# EAGLE design BitBeacon (EAGLE 7.4.0)
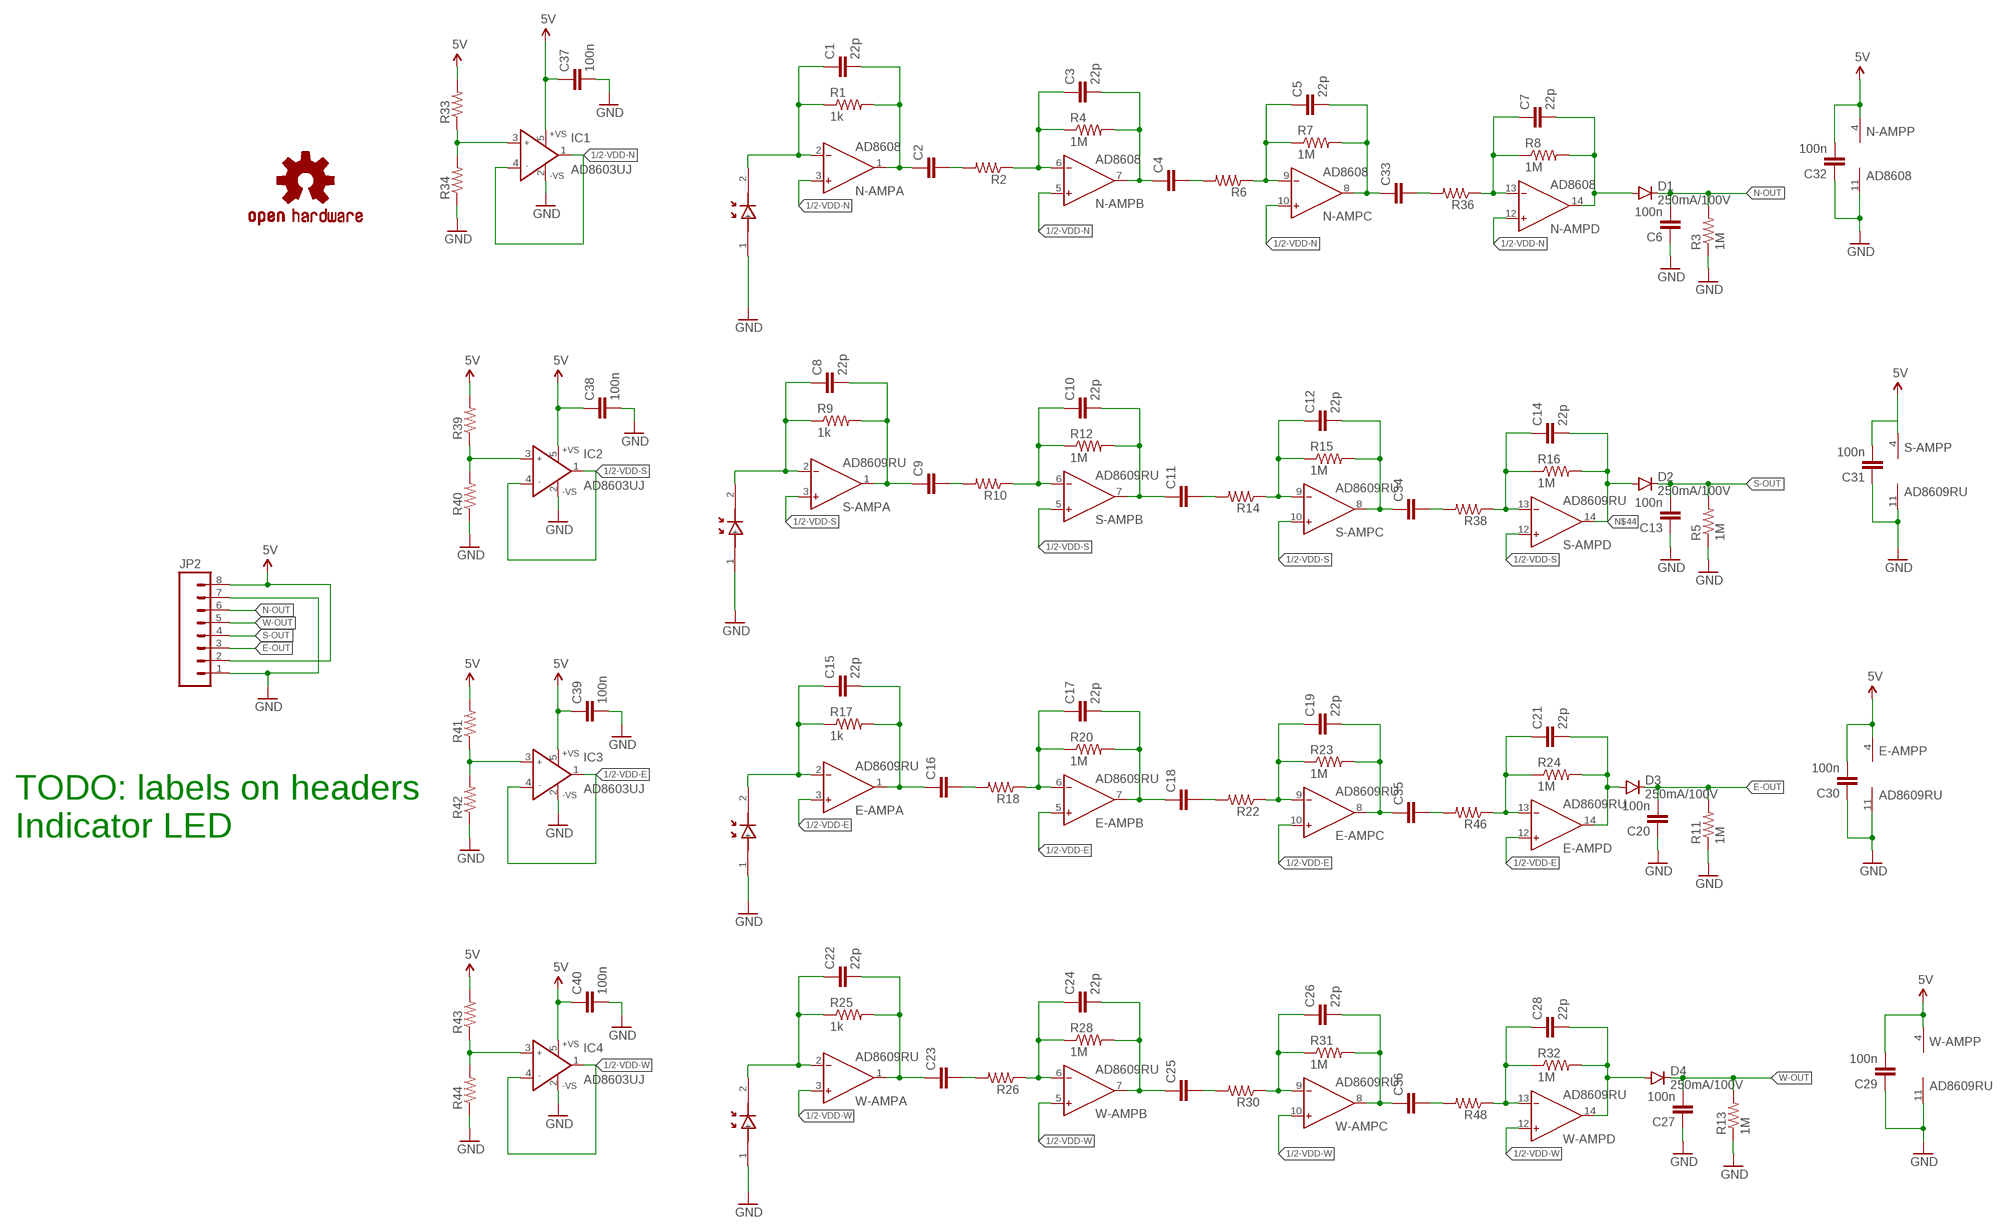
[diagram p0: schematic, sheet 1]

## Parts
C1  22p  C-EUC0402  [C0402]
C2  C-EUC0402  [C0402]
C3  22p  C-EUC0402  [C0402]
C4  C-EUC0402  [C0402]
C5  22p  C-EUC0402  [C0402]
C6  100n  C-EUC0402  [C0402]
C7  22p  C-EUC0402  [C0402]
C8  22p  C-EUC0402  [C0402]
C9  C-EUC0402  [C0402]
C10  22p  C-EUC0402  [C0402]
C11  C-EUC0402  [C0402]
C12  22p  C-EUC0402  [C0402]
C13  100n  C-EUC0402  [C0402]
C14  22p  C-EUC0402  [C0402]
C15  22p  C-EUC0402  [C0402]
C16  C-EUC0402  [C0402]
C17  22p  C-EUC0402  [C0402]
C18  C-EUC0402  [C0402]
C19  22p  C-EUC0402  [C0402]
C20  100n  C-EUC0402  [C0402]
C21  22p  C-EUC0402  [C0402]
C22  22p  C-EUC0402  [C0402]
C23  C-EUC0402  [C0402]
C24  22p  C-EUC0402  [C0402]
C25  C-EUC0402  [C0402]
C26  22p  C-EUC0402  [C0402]
C27  100n  C-EUC0402  [C0402]
C28  22p  C-EUC0402  [C0402]
C29  100n  C-EUC0402  [C0402]
C30  100n  C-EUC0402  [C0402]
C31  100n  C-EUC0402  [C0402]
C32  100n  C-EUC0402  [C0402]
C33  C-EUC0402  [C0402]
C34  C-EUC0402  [C0402]
C35  C-EUC0402  [C0402]
C36  C-EUC0402  [C0402]
C37  100n  C-EUC0402  [C0402]
C38  100n  C-EUC0402  [C0402]
C39  100n  C-EUC0402  [C0402]
C40  100n  C-EUC0402  [C0402]
D1  250mA/100V  DIODEBAS16  [SOD-323]
D2  250mA/100V  DIODEBAS16  [SOD-323]
D3  250mA/100V  DIODEBAS16  [SOD-323]
D4  250mA/100V  DIODEBAS16  [SOD-323]
E-AMP  AD8609RU  [TSSOP14]
E-PD1  BPW46  [PIN-PHOTODIODE]
IC1  AD8603UJ  [SOT23-5]
IC2  AD8603UJ  [SOT23-5]
IC3  AD8603UJ  [SOT23-5]
IC4  AD8603UJ  [SOT23-5]
JP2  M08NO_SILK  [1X08_PIN1_NO_SILK]
LOGO1  OSHW-LOGOS  [OSHW-LOGO-S]
N-AMP  AD8608  AD8609RU  [TSSOP14]
N-PD1  BPW46  [PIN-PHOTODIODE]
R1  1k  R-US_R0402  [R0402]
R2  R-US_R0402  [R0402]
R3  1M  R-US_R0402  [R0402]
R4  1M  R-US_R0402  [R0402]
R5  1M  R-US_R0402  [R0402]
R6  R-US_R0402  [R0402]
R7  1M  R-US_R0402  [R0402]
R8  1M  R-US_R0402  [R0402]
R9  1k  R-US_R0402  [R0402]
R10  R-US_R0402  [R0402]
R11  1M  R-US_R0402  [R0402]
R12  1M  R-US_R0402  [R0402]
R13  1M  R-US_R0402  [R0402]
R14  R-US_R0402  [R0402]
R15  1M  R-US_R0402  [R0402]
R16  1M  R-US_R0402  [R0402]
R17  1k  R-US_R0402  [R0402]
R18  R-US_R0402  [R0402]
R20  1M  R-US_R0402  [R0402]
R22  R-US_R0402  [R0402]
R23  1M  R-US_R0402  [R0402]
R24  1M  R-US_R0402  [R0402]
R25  1k  R-US_R0402  [R0402]
R26  R-US_R0402  [R0402]
R28  1M  R-US_R0402  [R0402]
R30  R-US_R0402  [R0402]
R31  1M  R-US_R0402  [R0402]
R32  1M  R-US_R0402  [R0402]
R33  R-US_R0402  [R0402]
R34  R-US_R0402  [R0402]
R36  R-US_R0402  [R0402]
R38  R-US_R0402  [R0402]
R39  R-US_R0402  [R0402]
R40  R-US_R0402  [R0402]
R41  R-US_R0402  [R0402]
R42  R-US_R0402  [R0402]
R43  R-US_R0402  [R0402]
R44  R-US_R0402  [R0402]
R46  R-US_R0402  [R0402]
R48  R-US_R0402  [R0402]
S-AMP  AD8609RU  [TSSOP14]
S-PD1  BPW46  [PIN-PHOTODIODE]
W-AMP  AD8609RU  [TSSOP14]
W-PD1  BPW46  [PIN-PHOTODIODE]

## Nets
1/2-VDD-E: E-AMP.3(A:IN+) E-AMP.5(B:IN+) E-AMP.10(C:IN+) E-AMP.12(D:IN+) IC3.1(OUT) IC3.4(IN-)
1/2-VDD-N: IC1.1(OUT) IC1.4(IN-) N-AMP.3(A:IN+) N-AMP.5(B:IN+) N-AMP.10(C:IN+) N-AMP.12(D:IN+)
1/2-VDD-S: IC2.1(OUT) IC2.4(IN-) S-AMP.3(A:IN+) S-AMP.5(B:IN+) S-AMP.10(C:IN+) S-AMP.12(D:IN+)
1/2-VDD-W: IC4.1(OUT) IC4.4(IN-) W-AMP.3(A:IN+) W-AMP.5(B:IN+) W-AMP.10(C:IN+) W-AMP.12(D:IN+)
5V: C29.2 C30.2 C31.2 C32.2 C37.1 C38.1 C39.1 C40.1 E-AMP.4(P:V+) IC1.5(+VS) IC2.5(+VS) IC3.5(+VS) IC4.5(+VS) JP2.2 JP2.8 N-AMP.4(P:V+) R33.2 R39.2 R41.2 R43.2 S-AMP.4(P:V+) W-AMP.4(P:V+)
E-OUT: C20.2 D3.C JP2.3 R11.2
GND: C6.1 C13.1 C20.1 C27.1 C29.1 C30.1 C31.1 C32.1 C37.2 C38.2 C39.2 C40.2 E-AMP.11(P:V-) E-PD1.1(+) IC1.2(-VS) IC2.2(-VS) IC3.2(-VS) IC4.2(-VS) JP2.1 JP2.7 N-AMP.11(P:V-) N-PD1.1(+) R3.1 R5.1 R11.1 R13.1 R34.1 R40.1 R42.1 R44.1 S-AMP.11(P:V-) S-PD1.1(+) W-AMP.11(P:V-) W-PD1.1(+)
N$1: C1.1 N-AMP.2(A:IN-) N-PD1.2(-) R1.1
N$2: C14.1 R16.1 R38.1 S-AMP.13(D:IN-)
N$3: C1.2 C2.1 N-AMP.1(A:OUT) R1.2
N$4: C8.1 R9.1 S-AMP.2(A:IN-) S-PD1.2(-)
N$5: C3.1 N-AMP.6(B:IN-) R2.1 R4.1
N$6: C3.2 C4.1 N-AMP.7(B:OUT) R4.2
N$7: C5.1 N-AMP.9(C:IN-) R6.1 R7.1
N$8: C5.2 C33.1 N-AMP.8(C:OUT) R7.2
N$9: IC1.3(IN+) R33.1 R34.2
N$10: C7.1 N-AMP.13(D:IN-) R8.1 R36.1
N$11: C7.2 D1.A N-AMP.14(D:OUT) R8.2
N$12: C10.1 R10.1 R12.1 S-AMP.6(B:IN-)
N$13: C10.2 C11.1 R12.2 S-AMP.7(B:OUT)
N$14: C12.1 R14.1 R15.1 S-AMP.9(C:IN-)
N$15: C12.2 C34.1 R15.2 S-AMP.8(C:OUT)
N$16: IC2.3(IN+) R39.1 R40.2
N$17: IC3.3(IN+) R41.1 R42.2
N$18: IC4.3(IN+) R43.1 R44.2
N$19: C15.1 E-AMP.2(A:IN-) E-PD1.2(-) R17.1
N$20: C15.2 C16.1 E-AMP.1(A:OUT) R17.2
N$21: C17.1 E-AMP.6(B:IN-) R18.1 R20.1
N$22: C17.2 C18.1 E-AMP.7(B:OUT) R20.2
N$23: C19.1 E-AMP.9(C:IN-) R22.1 R23.1
N$24: C19.2 C35.1 E-AMP.8(C:OUT) R23.2
N$25: C28.1 R32.1 R48.1 W-AMP.13(D:IN-)
N$26: C21.1 E-AMP.13(D:IN-) R24.1 R46.1
N$27: C2.2 R2.2
N$28: C22.1 R25.1 W-AMP.2(A:IN-) W-PD1.2(-)
N$29: C22.2 C23.1 R25.2 W-AMP.1(A:OUT)
N$30: C24.1 R26.1 R28.1 W-AMP.6(B:IN-)
N$31: C24.2 C25.1 R28.2 W-AMP.7(B:OUT)
N$32: C26.1 R30.1 R31.1 W-AMP.9(C:IN-)
N$33: C26.2 C36.1 R31.2 W-AMP.8(C:OUT)
N$34: C4.2 R6.2
N$35: C33.2 R36.2
N$36: C34.2 R38.2
N$37: C11.2 R14.2
N$38: C9.2 R10.2
N$39: C35.2 R46.2
N$40: C18.2 R22.2
N$41: C16.2 R18.2
N$42: C36.2 R48.2
N$43: C25.2 R30.2
N$44: C14.2 D2.A R16.2 S-AMP.14(D:OUT)
N$45: C23.2 R26.2
N$46: C21.2 D3.A E-AMP.14(D:OUT) R24.2
N$47: C28.2 D4.A R32.2 W-AMP.14(D:OUT)
N-OUT: C6.2 D1.C JP2.6 R3.2
S-AMP: C8.2 C9.1 R9.2 S-AMP.1(A:OUT)
S-OUT: C13.2 D2.C JP2.4 R5.2
W-OUT: C27.2 D4.C JP2.5 R13.2

## Notes on the sheet
- TODO: labels on headers
  Indicator LED

## Library data of the parts
C1-C40 = resistor:C-EU: CAPACITOR, European symbol
D1-D4 = SparkFun-DiscreteSemi:DIODE: Diode These are standard reverse protection diodes and small signal diodes. SMA package can handle up to about 1A. SOD-323 can handle about 200mA. What the SOD-323 package when ordering, there are some mfgs out there that are 5-pin packages.; PROD_ID: DIO-09646
E-AMP N-AMP S-AMP W-AMP = analog-devices:AD8609: Precision Micropower, Low Noise CMOS, Rail-to-Rail Input/Output Operational Amplifiers Source: http://www.analog.com/static/imported-files/data_sheets/AD8603_8607_8609.pdf; MF: ALTERA CORPORATION; MPN: AD8609ARUZ; OC_FARNELL: 1464994; OC_NEWARK: 59K6934
E-PD1 N-PD1 S-PD1 W-PD1 = Orlando:BPW46
IC1-IC4 = analog-devices:AD8603: Precision Micropower, Low Noise CMOS, Rail-to-Rail Input/Output Operational Amplifiers Source: http://www.analog.com/static/imported-files/data_sheets/AD8603_8607_8609.pdf; MF: ALTERA CORPORATION; MPN: AD8603AUJZ-REEL7; OC_FARNELL: 1651290; OC_NEWARK: 59K6904
JP2 = SparkFun-Connectors:M08: Header 8 Standard 8-pin 0.1" header. Use with straight break away headers (SKU : PRT-00116), right angle break away headers (PRT-00553), swiss pins (PRT-00743), machine pins (PRT-00117), and female headers (PRT-00115).
LOGO1 = SparkFun-Aesthetics:OSHW-LOGO: Open Source Hardware Logo This logo indicates the piece of hardware it is found on incorporates a OSHW license and/or adheres to the definition of open source hardware found here: http://freedomdefined.org/OSHW
R1-R18 R20 R22-R26 R28 R30-R34 R36 R38-R44 R46 R48 = resistor:R-US_: RESISTOR, American symbol

## Board
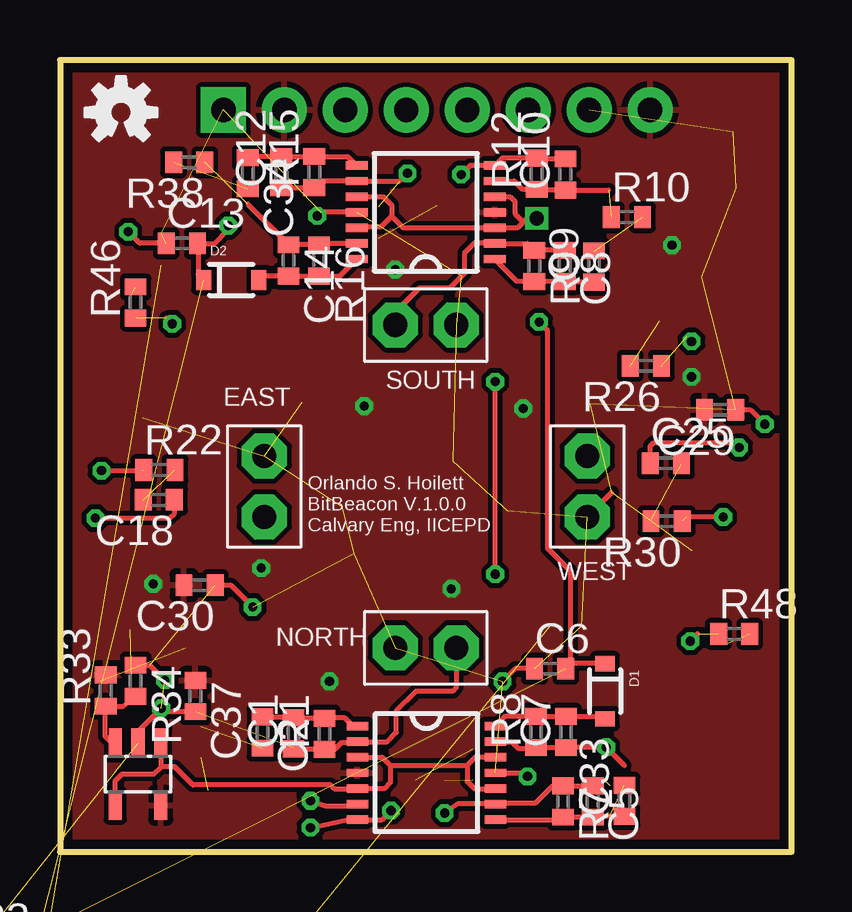
[diagram p1: board, top side]
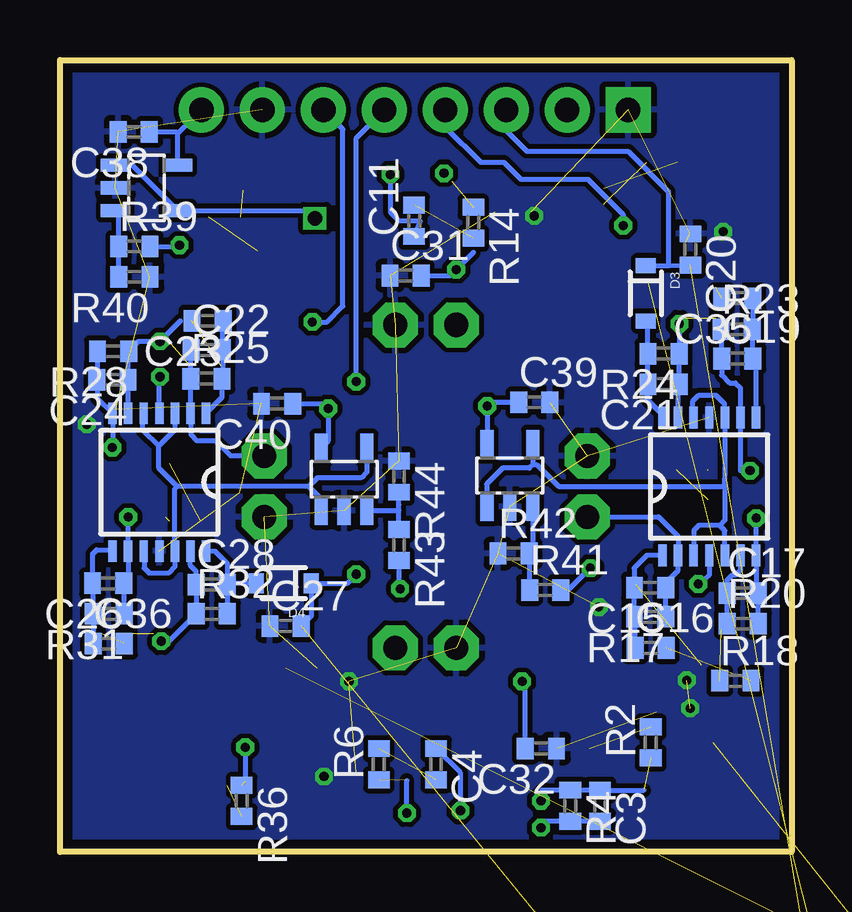
[diagram p2: board, bottom side, seen from below]

Size 30.48 x 33.02 mm. Coordinates in mm from the lower left corner, seen from the top.
Outline: 0,0 30.48,0 30.48,33.02 0,33.02 0,0
Copper layers (1*16): Top 0.0356mm / dielectric 1.5011mm / Bottom 0.0356mm
Design rules "LaenPCBOrder": minimum track width 6mil, minimum drill 13mil, track to track 6mil, track to pad 6mil, pad to pad 6mil, via to via 6mil, smd to smd 6mil, copper to edge 15mil, drill to drill 6mil, minimum pad ring 7mil, minimum via ring 7mil, stop-mask expansion 3mil, vias tented up to drill 0mil, thermal gap 10mil

### Footprints (pad centres in the part's own frame; a part is rotated, then mirrored left to right if it is on the bottom)
C0402 = smd 0.7 x 0.9: 1 -0.65,0; 2 0.65,0
SOD-323 = smd 0.63 x 0.83: A 1.15,0; C -1.15,0
TSSOP14 = smd 0.9 x 0.35: 1 -2.875,1.95; 2 -2.875,1.3; 3 -2.875,0.65; 4 -2.875,0; 5 -2.875,-0.65; 6 -2.875,-1.3; 7 -2.875,-1.95; 8 2.875,-1.95; 9 2.875,-1.3; 10 2.875,-0.65; 11 2.875,0; 12 2.875,0.65; 13 2.875,1.3; 14 2.875,1.95
PIN-PHOTODIODE = drill 1.016 pad 1.88 octagon: 1 -1.27,0; 2 1.27,0
SOT23-5 = smd 0.55 x 1.2: 1 -0.95,-1.3; 2 0,-1.3; 3 0.95,-1.3; 4 0.95,1.3; 5 -0.95,1.3
1X08_PIN1_NO_SILK = drill 1.016 pad 1.88 square: 1 0,0 | drill 1.016 pad 1.88: 2 2.54,0; 3 5.08,0; 4 7.62,0; 5 10.16,0; 6 12.7,0; 7 15.24,0; 8 17.78,0
R0402 = smd 0.7 x 0.9: 1 -0.65,0; 2 0.65,0

### Placement (x,y rotation side)
C1  9.73,4.95 90 top
C2  8.43,4.98 270 top
C3  7.98,1.93 270 bottom
C4  14.81,3.66 270 bottom
C5  22.2,2.11 270 top
C6  20.42,7.65 0 top
C7  21.08,5 90 top
C8  21.03,24.43 270 top
C9  22.25,24.41 90 top
C10  21.06,28.24 90 top
C11  15.72,26.31 90 bottom
C12  9.22,28.35 90 top
C13  5.08,25.37 0 top
C14  9.53,24.66 270 top
C15  5.89,11.02 180 bottom
C16  5.87,8.51 0 bottom
C17  2.03,10.79 0 bottom
C18  4.11,14.68 180 top
C19  2.26,20.57 0 bottom
C20  4.22,25.12 270 bottom
C21  5.33,19.51 180 bottom
C22  24.36,20.93 0 bottom
C23  24.33,22.15 180 bottom
C24  28.3,19.68 180 bottom
C25  25.25,16.21 0 top
C26  28.47,11.2 180 bottom
C27  21.08,9.42 0 bottom
C28  24.16,11.15 0 bottom
C29  27.51,18.44 180 top
C30  5.82,11.13 180 top
C31  16.08,24.03 0 bottom
C32  10.44,4.32 180 bottom
C33  23.52,2.13 90 top
C34  7.82,28.3 270 top
C35  2.26,23.09 180 bottom
C36  28.45,8.69 0 bottom
C37  5.64,6.5 270 top
C38  27.41,30.02 180 bottom
C39  10.72,18.75 0 bottom
C40  21.44,18.69 180 bottom
D1  22.71,6.71 270 top
D2  7.14,23.85 0 top
D3  6.07,23.29 270 bottom
D4  21.16,11.2 180 bottom
E-AMP  3.43,15.24 90 bottom
E-PD1  8.51,15.24 270 top
IC1  3.25,3.25 180 top
IC2  26.87,27.69 270 bottom
IC3  11.73,15.7 0 bottom
IC4  18.64,15.54 0 bottom
JP2  6.81,30.94 0 top
LOGO1  2.54,30.84 0 top
N-AMP  15.27,3.3 0 top
N-PD1  15.24,8.51 0 top
R1  11.02,4.93 90 top
R2  5.87,4.57 90 bottom
R3  -2.9,-4.01 0 top  (outside the outline)
R4  9.22,1.93 270 bottom
R5  -2.9,-8.79 0 top  (outside the outline)
R6  17.2,3.66 90 bottom
R7  20.95,2.11 270 top
R8  19.84,5 90 top
R9  19.76,24.43 270 top
R10  23.62,26.47 0 top
R11  -2.9,-13.56 0 top  (outside the outline)
R12  19.86,28.27 90 top
R13  -2.9,-18.34 0 top  (outside the outline)
R14  13.26,26.24 270 bottom
R15  10.59,28.35 90 top
R16  10.79,24.66 270 top
R17  5.89,9.8 180 bottom
R18  2.34,7.14 0 bottom
R20  2.03,9.53 0 bottom
R22  4.14,15.93 0 top
R23  2.29,21.79 0 bottom
R24  5.33,20.78 180 bottom
R25  24.38,19.74 0 bottom
R26  24.41,20.27 180 top
R28  28.27,20.88 180 bottom
R30  25.27,13.79 180 top
R31  28.45,9.93 180 bottom
R32  24.16,9.93 0 bottom
R33  1.91,6.73 90 top
R34  3.15,7.14 270 top
R36  22.91,2.13 270 bottom
R38  5.38,28.75 180 top
R39  27.38,25.25 0 bottom
R40  27.38,23.98 180 bottom
R41  10.26,10.92 0 bottom
R42  11.58,12.45 0 bottom
R43  16.36,12.8 270 bottom
R44  16.36,15.65 270 bottom
R46  3.15,22.91 90 top
R48  28.09,9.09 0 top
S-AMP  15.24,26.67 180 top
S-PD1  15.24,21.97 180 top
W-AMP  26.34,15.42 270 bottom
W-PD1  21.97,15.24 90 top

### Tracks (layer width: path | path; a pad name or v marks a point on that pad's centre or on a via)
1/2-VDD-E
  Bottom 0.203: E-AMP.5 2.78,13.4 3,13.61 | 3,13.61 3.86,13.61 4.06,13.41 4.06,12.38 E-AMP.3 | E-AMP.12 4.12,18.08 4.12,18.8 3.86,19.05 3.15,19.05 2.79,18.69 2.79,18.13 E-AMP.10 2.78,15.6 2.78,15.24 | 2.78,15.24 9.7,15.24 10.62,16.15 10.77,16.15 10.79,16.14 | IC3.4 10.79,16.14 | 10.79,16.14 10.92,16 12.04,16 12.7,15.34 12.7,14.41 IC3.1 | 2.78,15.24 2.78,13.83 3,13.61
1/2-VDD-N
  Top 0.203: N-AMP.3 13.42,3.95 13.77,3.61 | 13.77,3.61 13.77,2.9 13.51,2.64 N-AMP.5 11.43,2.64 11.28,2.79 5.54,2.79 4.78,3.56 4.22,3.56 | N-AMP.12 17.31,3.95 16.97,3.61 | 16.97,3.61 16.97,2.95 17.27,2.64 N-AMP.10 | 4.22,4.28 IC1.1 4.22,4.54 4.22,3.56 | 13.77,3.61 16.97,3.61 | IC1.4 2.3,2.96 2.59,3.25 3.91,3.25 4.22,3.56
1/2-VDD-S  (via drill 0.6)
  Top 0.203: v19.86,26.42 19.46,26.42 19.3,26.26 | 19.3,26.26 19.05,26.01 S-AMP.3 14.31,26.02 13.82,26.52 | S-AMP.10 13.47,27.32 13.82,26.98 13.82,26.52 | 13.82,26.52 13.36,26.06 12.4,26.06 S-AMP.12 | S-AMP.5 18.76,27.32 18.95,27.13 18.95,26.62 19.3,26.26
  Bottom 0.203: IC2.1 27.47,28.64 IC2.4 20.18,26.74 v19.86,26.42
1/2-VDD-W
  Bottom 0.203: 26.36,16.92 27.03,17.58 27.03,18.26 W-AMP.5 | W-AMP.3 25.69,17.59 26.36,16.92 | 25.6,15.24 26.36,16 26.36,16.92 | 20.12,15.24 25.6,15.24 | W-AMP.10 26.98,12.53 26.98,11.84 26.77,11.63 25.96,11.63 25.69,11.9 W-AMP.12 25.69,15.15 25.6,15.24 | IC4.4 17.69,15.83 17.93,15.6 19.76,15.6 20.12,15.24 | IC4.1 19.59,14.72 20.12,15.24
5V  (via drill 0.38)
  Bottom 0.203: E-AMP.4 3.43,11.53 v3.89,11.18 | R39.2 25.55,25.25 v25.5,25.3 | IC2.5 25.57,29.95 | 25.57,29.95 JP2.8 | C32.2 11.09,6.97 v11.23,7.11 | W-AMP.4 26.34,19.79 v26.31,19.81 | R41.2 9.3,10.92 v8.38,11.84 | 13.26,24.99 v13.97,24.28 | 14.02,24.33 v13.97,24.28 | C31.2 14.22,24.03 v13.97,24.28 | C40.1 19.51,18.69 v19.3,18.49 19.3,17.13 IC4.5 | IC3.5 v12.68,18.59 12.52,18.75 C39.1 | C38.1 25.64,30.02 25.57,29.95 | R43.2 16.36,11.02 v16.31,10.97
  pour Top (isolate 0.203): 30.48,33.02 30.48,0 0,0 0,33.02
E-OUT  (1 unrouted)
  Bottom 0.203: D3.C 5.1,24.44 | 5.1,24.44 C20.2 | JP2.3 11.89,30.07 11.02,29.21 6.81,29.21 5.13,27.53 5.13,24.47 5.1,24.44
GND  (via drill 0.38)  (32 unrouted)
  Top 0.203: N-AMP.11 19.33,3.3 v19.48,3.15 | 22.99,14.99 W-PD1.1 | C6.1 18.97,7.64 v18.44,7.11 | C29.1 28.75,18.44 v29.36,17.83 | C30.1 7.11,11.12 v8.03,10.21 | S-AMP.11 10.87,26.67 v10.72,26.52 | C13.1 3.33,25.38 v2.85,25.86 | R34.1 3.74,7.79 v4.37,7.16 | C37.2 4.36,5.85 v4.22,5.99 3.25,5.03 IC1.2
  pour Bottom (isolate 0.203): 30.48,33.02 30.48,0 0,0 0,33.02
N$1
  Top 0.203: N-PD1.2 16.51,6.86 16.36,6.71 14.83,6.71 14.02,5.89 14.02,4.98 13.64,4.6 N-AMP.2 12.36,4.57 11.73,4.57 11.44,4.28 R1.1 11,4.3 C1.1
N$2  (1 unrouted)
  Top 0.203: S-AMP.13 10.85,25.37 R16.1 C14.1 7.82,27.02
N$3
  Top 0.203: N-AMP.1 12.2,5.25 11.86,5.59 11.03,5.59 R1.2 10.01,5.58 C1.2 9.7,5.63 C2.1
N$4
  Top 0.203: C8.1 R9.1 19.48,25.37 S-AMP.2 18.09,25.4 17.27,25.4 16.87,24.99 16.87,24.13 16.26,23.52 14.99,23.52 13.97,22.5 S-PD1.2
N$5  (via drill 0.38)  (1 unrouted)
  Top 0.203: v10.44,2.13 11.05,1.93 12.32,1.93 N-AMP.6
  Bottom 0.203: v10.44,2.13 10.4,2.58 R4.1 C3.1 6.15,2.58
N$6  (via drill 0.38)
  Top 0.203: v13.79,1.73 13.42,1.35 N-AMP.7 12.32,1.42 v10.44,1.02
  Bottom 0.203: 14.64,4.17 C4.1 13.79,3.29 v13.79,1.73 | C3.2 R4.2 10.3,1.28 v10.44,1.02
N$7  (via drill 0.38)  (1 unrouted)
  Top 0.203: v16.03,1.63 16.57,2 N-AMP.9 18.17,2.03 19.81,2.03 20.54,2.76 R7.1 C5.1
  Bottom 0.203: v16.03,1.63 16.03,2.98
N$8
  Top 0.203: N-AMP.8 20.85,1.35 R7.2 C5.2 22.23,1.48 C33.1
N$9
  Top 0.203: R34.2 2.64,6.08 R33.1 1.88,6.06 1.88,4.83 2.15,4.55 IC1.3
N$10  (via drill 0.38)  (1 unrouted)
  Top 0.203: N-AMP.13 18.82,4.6 19.1,4.32 19.8,4.32 R8.1 C7.1 21.1,4.37 v22.76,4.37 23.52,3.61
  Bottom 0.203: v22.76,4.37 22.76,2.94
N$11
  Top 0.203: N-AMP.14 18.54,5.65 R8.2 C7.2 22.61,5.65 D1.A
N$12  (1 unrouted)
  Top 0.203: S-AMP.6 18.92,27.97 19.25,27.64 19.85,27.64 R12.1 19.89,27.59 C10.1 22.86,27.59
N$13  (via drill 0.38)
  Top 0.203: C10.2 19.89,28.89 R12.2 18.41,28.92 S-AMP.7 17.09,28.62 v16.71,28.25
  Bottom 0.203: v16.71,28.25 16.71,26.67 16.36,26.31 15.48,26.31 C11.1
N$14  (via drill 0.38)  (1 unrouted)
  Top 0.203: v14.48,28.3 14.15,27.97 S-AMP.9 10.87,27.97 R15.1 C12.1
N$15
  Top 0.203: S-AMP.8 11.99,29 R15.2 C12.2 7.87,29 C34.1
N$16
  Bottom 0.203: R40.2 R39.1 28.03,26.59 IC2.3
N$17
  Bottom 0.203: IC3.3 10.79,12.59 R42.2 10.93,10.94 R41.1
N$18
  Bottom 0.203: R43.1 16.36,14.24 | R44.2 16.36,14.48 16.36,14.24 | IC4.3 16.36,14.24
N$19
  Bottom 0.203: E-PD1.2 5.54,13.97 4.72,13.16 E-AMP.2 4.72,11.73 5.24,11.22 C15.1 R17.1
N$20
  Bottom 0.203: E-AMP.1 6.03,12.37 6.55,11.84 6.55,11.03 C15.2 R17.2 6.52,9.78 C16.1
N$21  (1 unrouted)
  Bottom 0.203: 2.94,9.27 R20.1 C17.1 2.69,10.8 2.69,11.33 2.49,11.53 2.34,11.53 2.13,11.74 E-AMP.6
N$22  (via drill 0.38)
  Top 0.203: v1.47,13.92 4.57,13.92 4.78,14.12 4.78,14.67 C18.1
  Bottom 0.203: v1.47,13.92 v1.48,13.91 E-AMP.7 1.48,10.89 C17.2 R20.2
N$23  (via drill 0.38)  (1 unrouted)
  Top 0.203: v1.73,15.9 3.46,15.9
  Bottom 0.203: v1.73,15.9 2.13,15.9 E-AMP.9 2.13,19.36 2.34,19.56 2.59,19.56 2.91,19.88 C19.1 2.91,21.77 R23.1
N$24
  Bottom 0.203: C35.1 1.61,21.82 R23.2 1.64,20.6 C19.2 1.48,20.44 E-AMP.8
N$25  (via drill 0.38)  (1 unrouted)
  Top 0.203: 26.31,8.84 v26.26,8.79 26.57,9.09
  Bottom 0.203: 26.36,8.69 v26.26,8.79 25.95,8.79 R32.1 C28.1 24.8,11.7 25.04,11.94 W-AMP.13
N$26  (via drill 0.38)  (1 unrouted)
  Top 0.203: 4.43,22.26 v4.67,22.02
  Bottom 0.203: E-AMP.13 4.73,19.46 C21.1 R24.1 v4.67,22.02 4.52,22.17
N$27  (1 unrouted)
N$28
  Bottom 0.203: W-PD1.2 23.37,16.51 24,17.14 24.77,17.14 25.02,17.4 25.02,18.27 W-AMP.2 R25.1 25.03,20.9 C22.1
N$29
  Bottom 0.203: W-AMP.1 23.73,18.95 R25.2 23.71,19.76 C22.2 23.71,22.12 C23.1
N$30  (via drill 0.38)  (1 unrouted)
  Top 0.203: 26.11,21.49 v26.31,21.29
  Bottom 0.203: W-AMP.6 C24.1 27.65,20.85 R28.1 27.21,21.29 v26.31,21.29 25.45,22.15
N$31  (via drill 0.38)
  Top 0.203: C25.1 24.59,16.22 24.59,16.92 24.74,17.07 28.09,17.07 v28.3,16.87
  Bottom 0.203: R28.2 28.92,19.71 | 28.92,19.71 C24.2 | v28.3,16.87 v28.29,16.87 W-AMP.7 28.92,18.92 28.92,19.71
N$32  (via drill 0.38)  (1 unrouted)
  Top 0.203: v27.64,13.97 26.1,13.97
  Bottom 0.203: v27.64,13.97 v27.64,13.96 W-AMP.9 27.64,11.38 C26.1 27.82,9.96 R31.1
N$33
  Bottom 0.203: W-AMP.8 28.34,12.6 28.96,12.6 29.12,12.43 C26.2 29.12,9.96 R31.2 C36.1
N$34  (1 unrouted)
N$35  (1 unrouted)
N$36  (1 unrouted)
N$37  (1 unrouted)
N$38  (1 unrouted)
N$39  (1 unrouted)
N$40  (1 unrouted)
N$41  (1 unrouted)
N$42  (1 unrouted)
N$43  (1 unrouted)
N$44
  Top 0.203: S-AMP.14 11.66,24.01 R16.2 C14.2 8.45,24.01 D2.A
N$45  (1 unrouted)
N$46
  Bottom 0.203: E-AMP.14 5.38,18.23 5.99,18.85 5.99,19.5 C21.2 R24.2 5.98,22.05 D3.A
N$47
  Bottom 0.203: W-AMP.14 24.02,12.54 23.52,12.04 23.52,11.17 C28.2 | C28.2 R32.2 | D4.A 23.45,11.2 C28.2
N-OUT  (via drill 0.38)  (1 unrouted)
  Top 0.203: D1.C 21.28,7.86 | 21.28,7.86 C6.2 | 21.28,7.86 21.28,11.69 20.32,12.65 20.32,21.74 v19.96,22.1
  Bottom 0.203: JP2.6 18.69,30.12 18.69,22.76 19.36,22.1 v19.96,22.1
S-AMP
  Top 0.203: S-AMP.1 19.05,23.79 R9.2 C8.2 21.06,23.76 C9.1
S-OUT  (via drill 0.38)  (1 unrouted)
  Top 0.203: v7.01,26.11 7.01,25.96 6.4,25.35 5.75,25.35 | 5.75,25.35 C13.2 | 5.75,25.35 5.75,24.08 D2.C
  Bottom 0.203: JP2.4 14.43,30.23 12.95,28.75 11.99,28.75 11.28,28.04 8.48,28.04 7.01,26.57 v7.01,26.11
W-OUT  (via drill 0.38)  (1 unrouted)
  Top 0.203: v18.14,11.58 v18.14,19.61
  Bottom 0.203: C27.2 20.01,9.85 D4.C 18.52,11.2 v18.14,11.58 | JP2.5 18.14,29.77 v18.14,19.61

### Text on the board
_tsilk: EAST | SOUTH | Orlando S. Hoilett / BitBeacon V.1.0.0 / Calvary Eng, IICEPD | WEST | NORTH